# Altium schematic sheet UserInterface.SchDoc
size A4
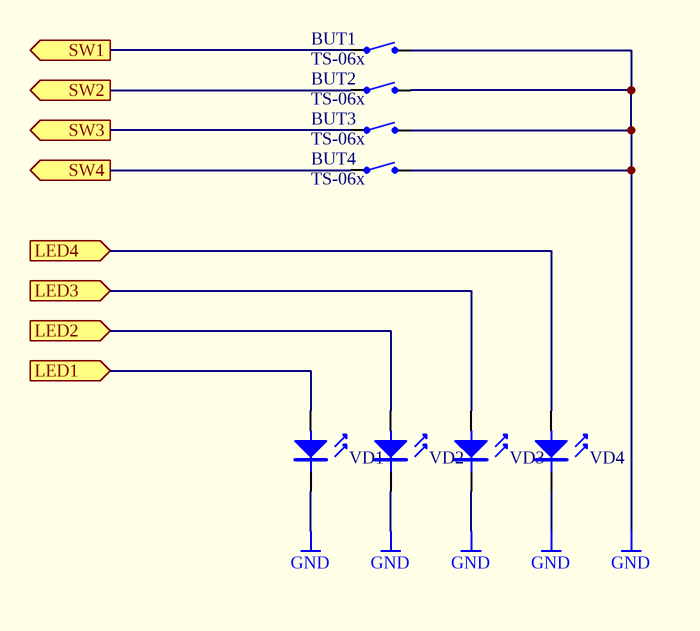
[diagram p0: UserInterface.SchDoc]

## Parts
BUT1  TS-06x  [BUT_6x6]
BUT2  TS-06x  [BUT_6x6]
BUT3  TS-06x  [BUT_6x6]
BUT4  TS-06x  [BUT_6x6]
VD1  LED  [LED_3MM]  (value not drawn)
VD2  LED  [LED_3MM]  (value not drawn)
VD3  LED  [LED_3MM]  (value not drawn)
VD4  LED  [LED_3MM]  (value not drawn)

## Ports
LED1 (in), LED2 (in), LED3 (in), LED4 (in), SW1 (out), SW2 (out), SW3 (out), SW4 (out)

## Nets
GND: BUT1.1 BUT2.1 BUT3.1 BUT4.1 VD1.2(K) VD2.2(K) VD3.2(K) VD4.2(K)
LED1: VD1.1(A1) ; port LED1
LED2: VD2.1(A1) ; port LED2
LED3: VD3.1(A1) ; port LED3
LED4: VD4.1(A1) ; port LED4
SW1: BUT1.2 ; port SW1
SW2: BUT2.2 ; port SW2
SW3: BUT3.2 ; port SW3
SW4: BUT4.2 ; port SW4

## Library data of the parts
BUT1-BUT4 = SW_TS06: Tactile push-button
VD1-VD4 = LED: LED, 3mm